# EAGLE design 2 byte output (EAGLE 9.5.0)
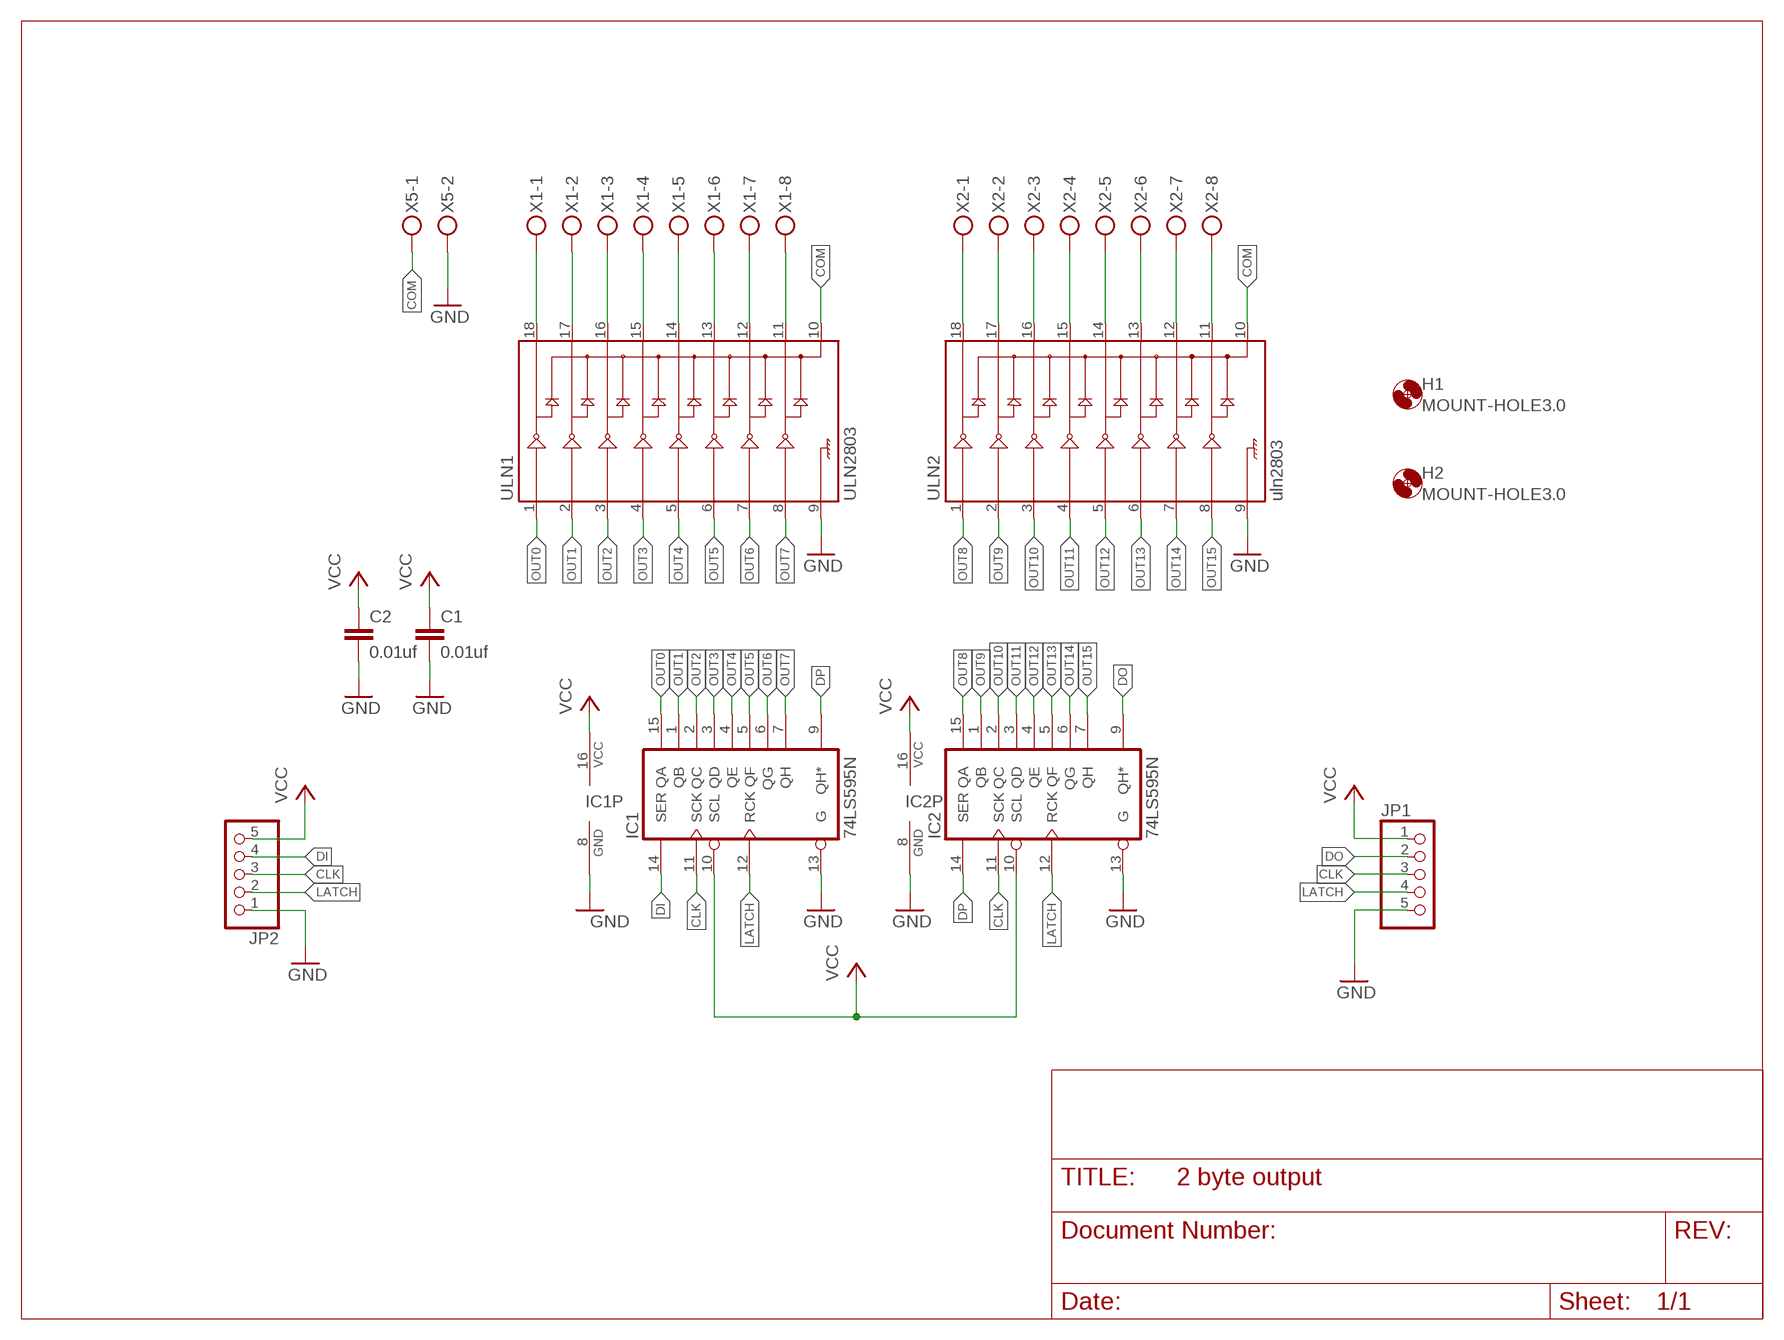
[diagram p0: schematic, sheet 1]

## Parts
C1  0.01uf  C-EU050-035X075  [C050-035X075]
C2  0.01uf  C-EU050-035X075  [C050-035X075]
H1  MOUNT-HOLE3.0  [3,0]
H2  MOUNT-HOLE3.0  [3,0]
IC1  74LS595N  [DIL16]
IC2  74LS595N  [DIL16]
JP1  PINHD-1X5/90  [1X05/90]
JP2  PINHD-1X5/90  [1X05/90]
ULN1  ULN2803  ULN2803DIP  [DIL18]
ULN2  uln2803  ULN2803DIP  [DIL18]
X1  MKDSN1,5/8-5,08  [MKDSN1,5/8-5,08]
X2  MKDSN1,5/8-5,08  [MKDSN1,5/8-5,08]
X5  MKDSN1,5/2-5,08  [MKDSN1,5/2-5,08]

## Nets
CLK: IC1.11(SCK) IC2.11(SCK) JP1.3 JP2.3
COM: ULN1.10 ULN2.10 X5.1
DI: IC1.14(SER) JP2.4
DO: IC2.9(QH*) JP1.2
DP: IC1.9(QH*) IC2.14(SER)
GND: C1.2 C2.2 IC1.8(GND) IC1.13(G) IC2.8(GND) IC2.13(G) JP1.5 JP2.1 ULN1.9 ULN2.9 X5.2
LATCH: IC1.12(RCK) IC2.12(RCK) JP1.4 JP2.2
N$1: ULN1.18 X1.1
N$2: ULN1.17 X1.2
N$3: ULN1.16 X1.3
N$4: ULN1.15 X1.4
N$5: ULN1.14 X1.5
N$6: ULN1.13 X1.6
N$7: ULN1.12 X1.7
N$8: ULN1.11 X1.8
N$9: ULN2.18 X2.1
N$10: ULN2.17 X2.2
N$11: ULN2.16 X2.3
N$12: ULN2.15 X2.4
N$13: ULN2.14 X2.5
N$14: ULN2.13 X2.6
N$15: ULN2.12 X2.7
N$16: ULN2.11 X2.8
OUT0: IC1.15(QA) ULN1.1
OUT1: IC1.1(QB) ULN1.2
OUT2: IC1.2(QC) ULN1.3
OUT3: IC1.3(QD) ULN1.4
OUT4: IC1.4(QE) ULN1.5
OUT5: IC1.5(QF) ULN1.6
OUT6: IC1.6(QG) ULN1.7
OUT7: IC1.7(QH) ULN1.8
OUT8: IC2.15(QA) ULN2.1
OUT9: IC2.1(QB) ULN2.2
OUT10: IC2.2(QC) ULN2.3
OUT11: IC2.3(QD) ULN2.4
OUT12: IC2.4(QE) ULN2.5
OUT13: IC2.5(QF) ULN2.6
OUT14: IC2.6(QG) ULN2.7
OUT15: IC2.7(QH) ULN2.8
VCC: C1.1 C2.1 IC1.10(SCL) IC1.16(VCC) IC2.10(SCL) IC2.16(VCC) JP1.1 JP2.5

## Library data of the parts
C1 C2 = resistor:C-EU: CAPACITOR, European symbol
H1 H2 = holes:MOUNT-HOLE: MOUNTING HOLE with drill center marker
IC1 IC2 = 74xx-us:74*595: 8-bit SHIFT REGISTER, output latch
JP1 JP2 = pinhead:PINHD-1X5: PIN HEADER
ULN1 ULN2 = SparkFun-IC-Special-Function:ULN2803: Darlington Driver(IC-07959, low stock) ULN2803 Darlington array. 500mA max per channel, 8-channel package. Spark Fun Electronics SKU : COM-00312
X1 X2 = con-phoenix-508:MKDSN1,5/8-5,08: MKDSN 1,5/ 8-5,08 Printklemme Nennstrom: 13,5 A Nennspannung: 250 V Rastermaß: 5,08 mm Polzahl: 8 Anschlussart: Schraubanschluss Montage: Löten Anschlussrichtung Leiter/Platine: 0 ° Artikelnummer: 1729186 Source: http://eshop.phoenixcontact.com .. 1729186.pdf
X5 = con-phoenix-508:MKDSN1,5/2-5,08: MKDSN 1,5/ 2-5,08 Printklemme Nennstrom: 13,5 A Nennspannung: 250 V Rastermaß: 5,08 mm Polzahl: 2 Anschlussart: Schraubanschluss Montage: Löten Anschlussrichtung Leiter/Platine: 0 ° Artikelnummer: 1729128 Source: http://eshop.phoenixcontact.com .. 1729128.pdf

## Board
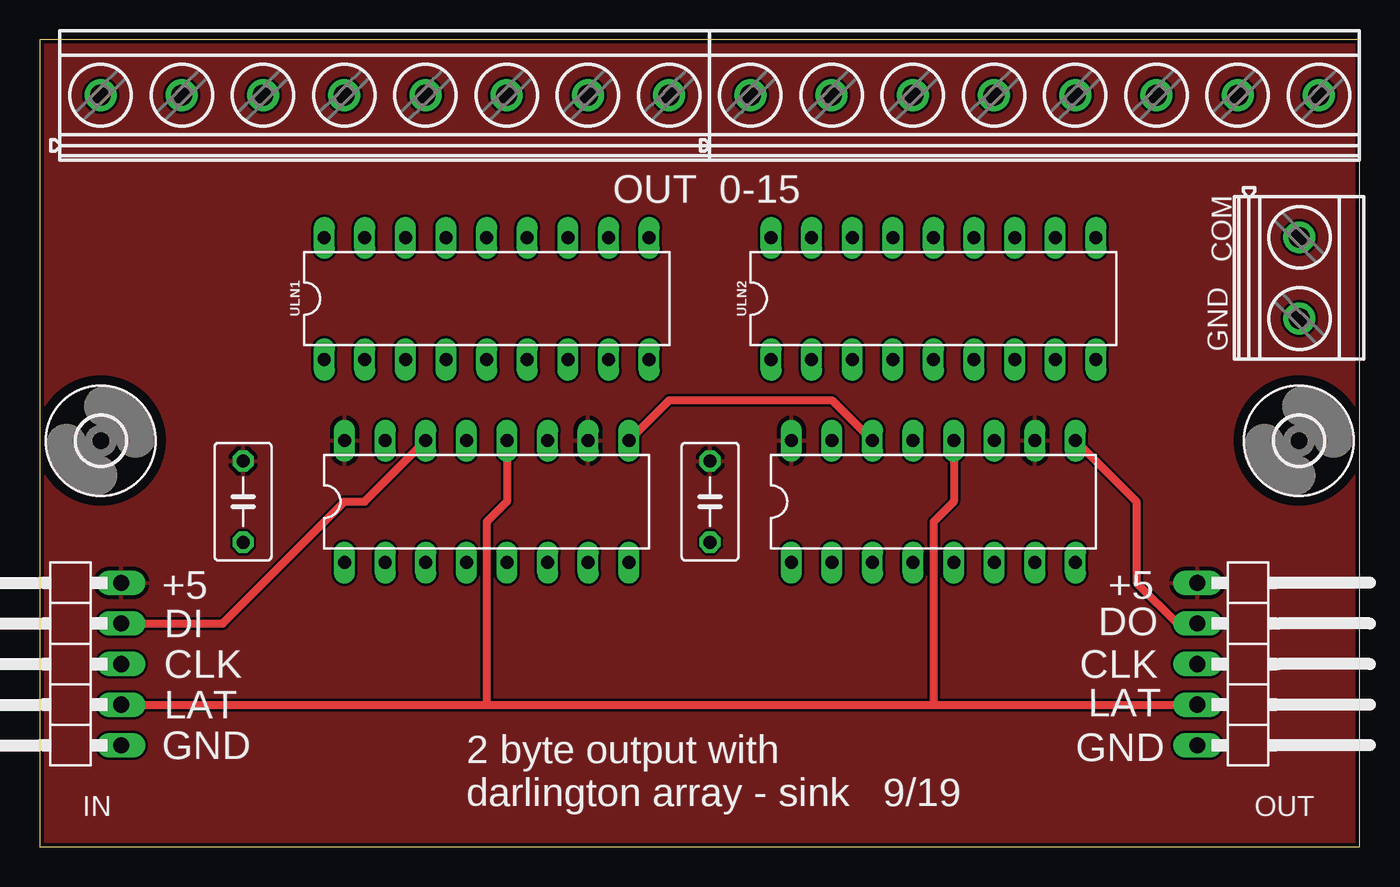
[diagram p1: board, top side]
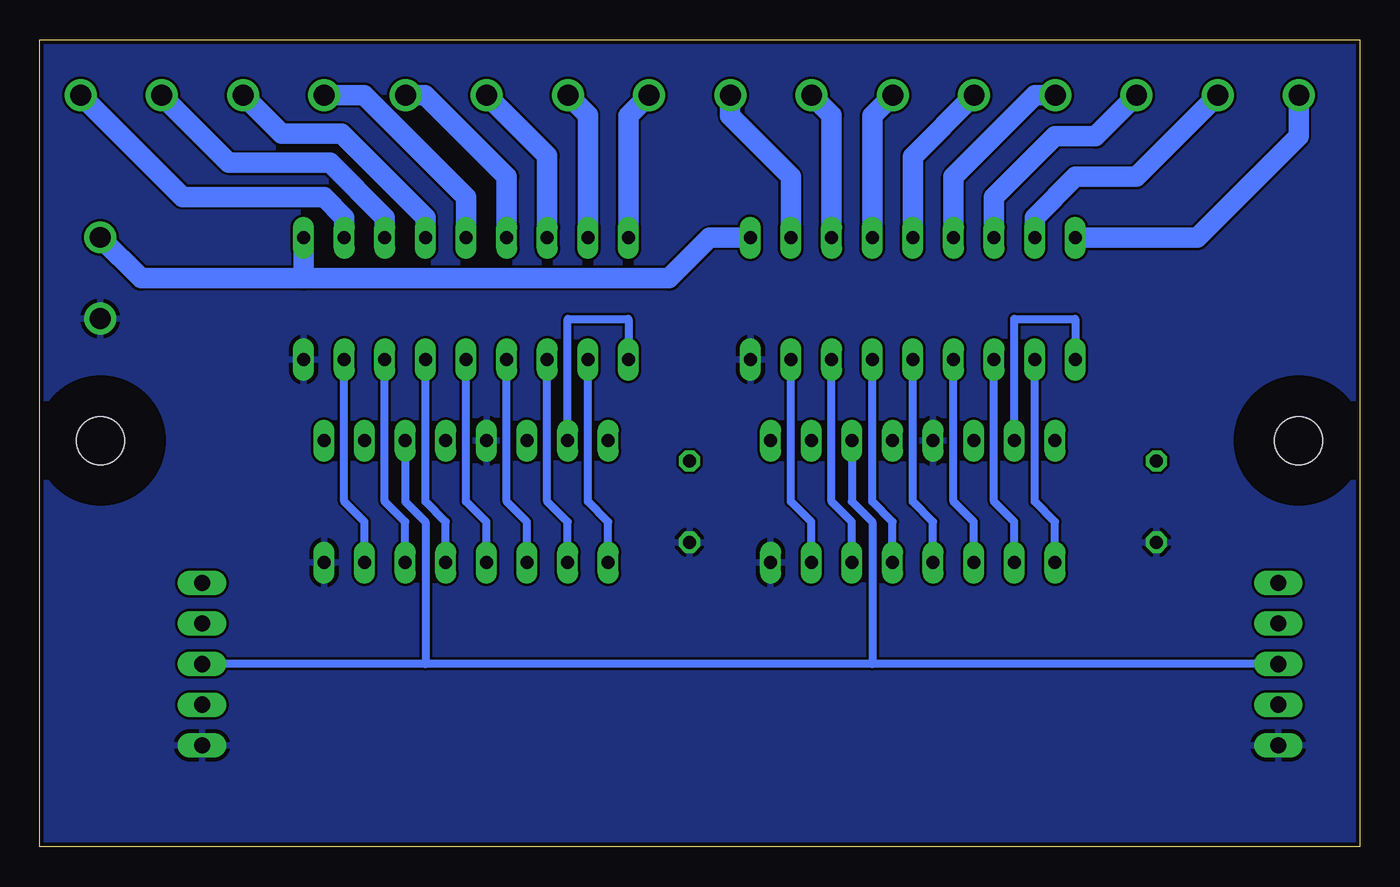
[diagram p2: board, bottom side, seen from below]

Size 82.53 x 50.47 mm. Coordinates in mm from the lower left corner, seen from the top.
Outline: 0,0 82.53,0 82.53,50.47 0,50.47 0,0
Copper layers (1*16): Top 0.035mm / dielectric 1.5mm / Bottom 0.035mm
Design rules "SeeedStudio_2layer": minimum track width 6mil, minimum drill 12mil, track to track 6mil, track to pad 6mil, pad to pad 6mil, via to via 6mil, smd to smd 0mil, copper to edge 10mil, drill to drill 10mil, minimum pad ring 10mil, minimum via ring 6mil, stop-mask expansion 2mil, vias tented up to drill 100mil, thermal gap 10mil

### Footprints (pad centres in the part's own frame; a part is rotated, then mirrored left to right if it is on the bottom)
C050-035X075 = drill 0.813 octagon: 1 -2.54,0; 2 2.54,0
3,0 = hole 3: 0,0
DIL16 = drill 0.813 long: 1 -8.89,-3.81; 2 -6.35,-3.81; 3 -3.81,-3.81; 4 -1.27,-3.81; 5 1.27,-3.81; 6 3.81,-3.81; 7 6.35,-3.81; 8 8.89,-3.81; 9 8.89,3.81; 10 6.35,3.81; 11 3.81,3.81; 12 1.27,3.81; 13 -1.27,3.81; 14 -3.81,3.81; 15 -6.35,3.81; 16 -8.89,3.81
1X05/90 = drill 1.016 long: 1 -5.08,-3.81; 2 -2.54,-3.81; 3 0,-3.81; 4 2.54,-3.81; 5 5.08,-3.81
DIL18 = drill 0.813 long: 1 -10.16,-3.81; 2 -7.62,-3.81; 3 -5.08,-3.81; 4 -2.54,-3.81; 5 0,-3.81; 6 2.54,-3.81; 7 5.08,-3.81; 8 7.62,-3.81; 9 10.16,-3.81; 10 10.16,3.81; 11 7.62,3.81; 12 5.08,3.81; 13 2.54,3.81; 14 0,3.81; 15 -2.54,3.81; 16 -5.08,3.81; 17 -7.62,3.81; 18 -10.16,3.81
MKDSN1,5/8-5,08 = drill 1.3 pad 2: 1 -17.801,0.025; 2 -12.721,0.025; 3 -7.641,0.025; 4 -2.561,0.025; 5 2.519,0.025; 6 7.599,0.025; 7 12.679,0.025; 8 17.759,0.025
MKDSN1,5/2-5,08 = drill 1.3 pad 2: 1 -2.561,0.025; 2 2.519,0.025

### Placement (x,y rotation side)
C1  12.7,21.59 270 top
C2  41.91,21.59 270 top
H1  3.81,25.4 0 top
H2  78.74,25.4 0 top
IC1  27.94,21.59 0 top
IC2  55.88,21.59 0 top
JP1  76.2,11.43 270 top
JP2  1.27,11.43 90 top
ULN1  27.94,34.29 0 top
ULN2  55.88,34.29 0 top
X1  21.59,46.99 0 top
X2  62.23,46.99 0 top
X5  78.74,35.56 270 top

### Tracks (layer width: path | path; a pad name or v marks a point on that pad's centre or on a via)
CLK
  Bottom 0.508: JP2.3 30.48,11.43 | 30.48,11.43 58.42,11.43 | 58.42,11.43 JP1.3 | IC2.11 59.69,21.59 58.42,20.32 58.42,11.43 | IC1.11 31.75,21.59 30.48,20.32 30.48,11.43
COM
  Bottom 1.27: ULN1.10 40.64,38.1 43.18,35.56 66.04,35.56 | ULN2.10 66.04,35.56 | 66.04,35.56 76.2,35.56 X5.1
DI
  Top 0.508: IC1.14 20.32,21.59 19.05,21.59 11.43,13.97 JP2.4
DO
  Top 0.508: IC2.9 68.58,21.59 68.58,16.51 71.12,13.97 JP1.2
DP
  Top 0.508: IC1.9 39.37,27.94 49.53,27.94 IC2.14
GND
  pour Bottom: -3.81,54.61 85.09,54.61 85.09,-2.54 -3.81,-2.54
LATCH
  Top 0.508: JP2.2 27.94,8.89 | 27.94,8.89 55.88,8.89 | 55.88,8.89 JP1.4 | IC2.12 57.15,21.59 55.88,20.32 55.88,8.89 | IC1.12 29.21,21.59 27.94,20.32 27.94,8.89
N$1
  Bottom 1.27: ULN1.18 10.16,38.1 3.81,44.45 3.81,46.99 X1.1
N$2
  Bottom 1.27: ULN1.17 20.32,39.37 17.78,41.91 13.97,41.91 X1.2
N$3
  Bottom 1.27: ULN1.16 22.86,40.64 19.05,44.45 16.51,44.45 X1.3
N$4
  Bottom 1.27: ULN1.15 25.4,41.91 20.3,47.02 X1.4
N$5
  Bottom 1.27: ULN1.14 27.94,43.18 X1.5
N$6
  Bottom 1.27: ULN1.13 30.48,45.72 X1.6
N$7
  Bottom 1.27: X1.7 33.02,45.77 ULN1.12
N$8
  Bottom 1.27: ULN1.11 35.56,41.91 39.37,45.72 39.37,46.99 X1.8
N$9
  Bottom 1.27: ULN2.18 45.72,45.72 X2.1
N$10
  Bottom 1.27: ULN2.17 48.26,45.77 X2.2
N$11
  Bottom 1.27: ULN2.16 50.8,43.23 X2.3
N$12
  Bottom 1.27: ULN2.15 53.34,41.91 58.45,47.02 X2.4
N$13
  Bottom 1.27: ULN2.14 55.88,40.64 62.26,47.02 X2.5
N$14
  Bottom 1.27: ULN2.13 58.42,39.37 63.65,44.6 67.42,44.6 X2.6
N$15
  Bottom 1.27: ULN2.12 60.96,39.37 64.39,42.8 70.74,42.8 74.91,46.97 X2.7
N$16
  Bottom 1.27: ULN2.11 63.5,39.37 64.77,40.64 73.61,40.64 X2.8
OUT0
  Bottom 0.508: IC1.15 21.59,33.02 17.78,33.02 ULN1.1
OUT1
  Bottom 0.508: IC1.1 19.05,20.32 20.32,21.59 ULN1.2
OUT2
  Bottom 0.508: IC1.2 21.59,20.32 22.86,21.59 ULN1.3
OUT3
  Bottom 0.508: IC1.3 24.13,20.32 25.4,21.59 ULN1.4
OUT4
  Bottom 0.508: IC1.4 26.67,20.32 27.94,21.59 ULN1.5
OUT5
  Bottom 0.508: IC1.5 29.21,20.32 30.48,21.59 ULN1.6
OUT6
  Bottom 0.508: IC1.6 31.75,20.32 33.02,21.59 ULN1.7
OUT7
  Bottom 0.508: IC1.7 34.29,20.32 35.56,21.59 ULN1.8
OUT8
  Bottom 0.508: IC2.15 49.53,33.02 45.72,33.02 ULN2.1
OUT9
  Bottom 0.508: IC2.1 46.99,20.32 48.26,21.59 ULN2.2
OUT10
  Bottom 0.508: IC2.2 49.53,20.32 50.8,21.59 ULN2.3
OUT11
  Bottom 0.508: IC2.3 52.07,20.32 53.34,21.59 ULN2.4
OUT12
  Bottom 0.508: IC2.4 54.61,20.32 55.88,21.59 ULN2.5
OUT13
  Bottom 0.508: IC2.5 57.15,20.32 58.42,21.59 ULN2.6
OUT14
  Bottom 0.508: IC2.6 59.69,20.32 60.96,21.59 ULN2.7
OUT15
  Bottom 0.508: IC2.7 62.23,20.32 63.5,21.59 ULN2.8
VCC
  pour Top: -2.54,-3.81 -2.54,58.42 87.63,58.42 87.63,-3.81

### Text on the board
tNames: OUT 0-15 | COM | GND | +5 | +5 | DI | DO | CLK | CLK | LAT | LAT | GND | GND | 2 byte output with / darlington array - sink 9/19 | IN | OUT